# Altium schematic sheet Y1BVER2.0_1.SchDoc
size A3
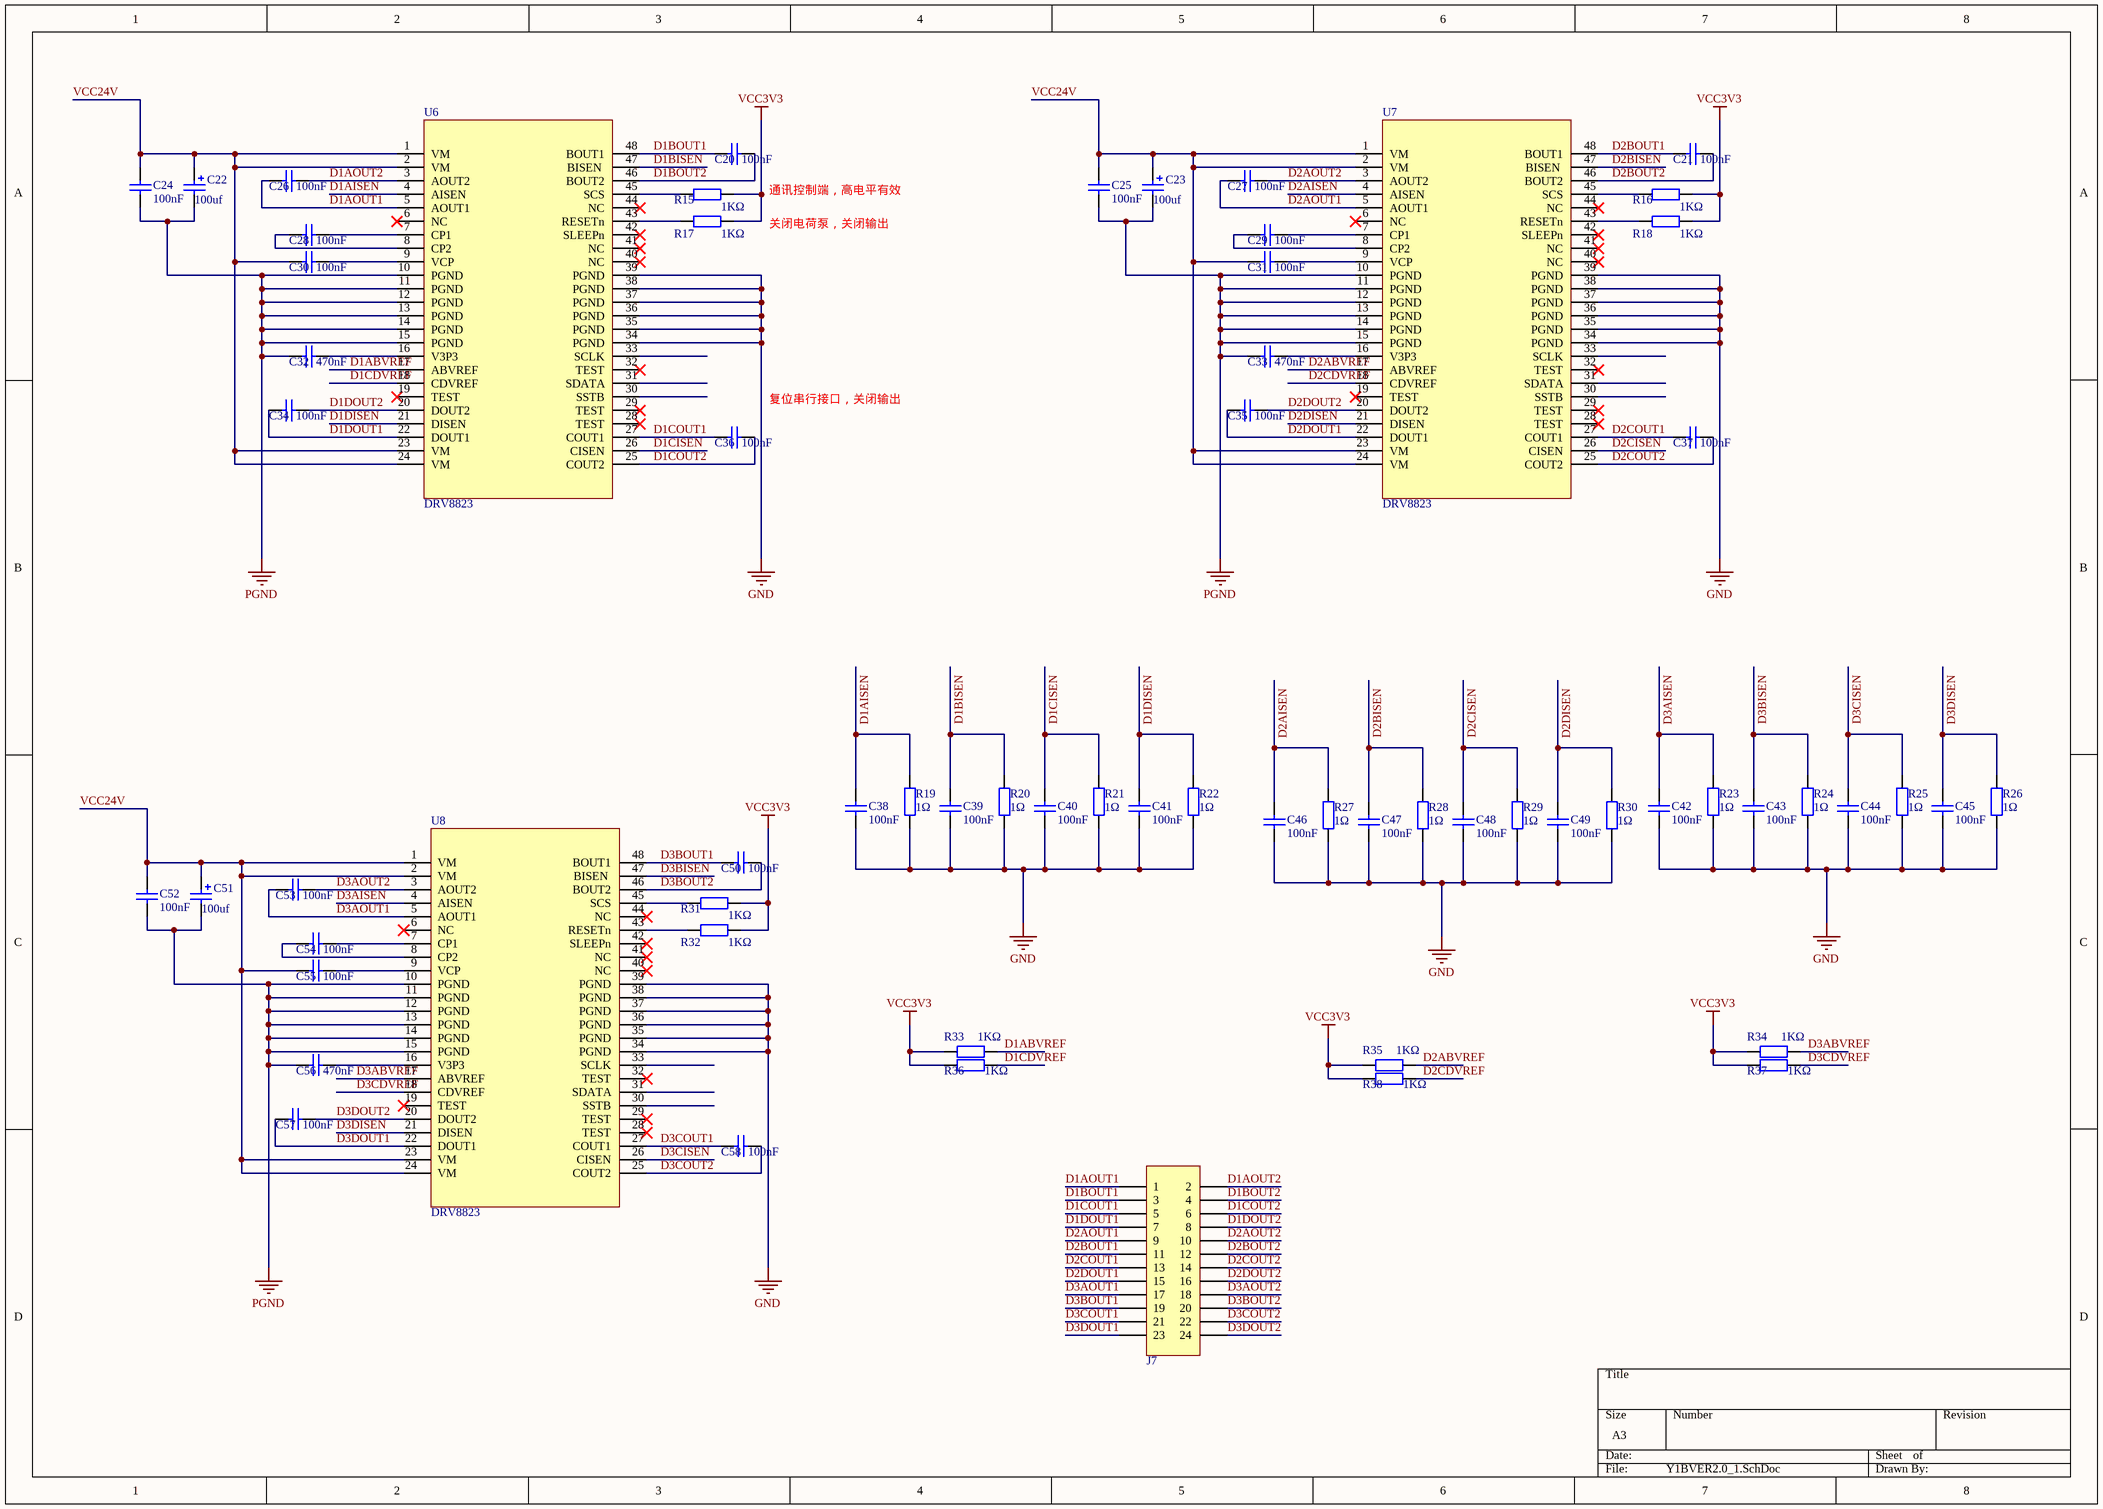
[diagram p0: Y1BVER2.0_1.SchDoc]

## Parts
C20  100nF  [0603_C]
C21  100nF  [0603_C]
C22  100uf  [E_6.3*5.4]
C23  100uf  [E_6.3*5.4]
C24  100nF  [0603_C]
C25  100nF  [0603_C]
C26  100nF  [0603_C]
C27  100nF  [0603_C]
C28  100nF  [0603_C]
C29  100nF  [0603_C]
C30  100nF  [0603_C]
C31  100nF  [0603_C]
C32  470nF  [0603_C]
C33  470nF  [0603_C]
C34  100nF  [0603_C]
C35  100nF  [0603_C]
C36  100nF  [0603_C]
C37  100nF  [0603_C]
C38  100nF  [0603_C]
C39  100nF  [0603_C]
C40  100nF  [0603_C]
C41  100nF  [0603_C]
C42  100nF  [0603_C]
C43  100nF  [0603_C]
C44  100nF  [0603_C]
C45  100nF  [0603_C]
C46  100nF  [0603_C]
C47  100nF  [0603_C]
C48  100nF  [0603_C]
C49  100nF  [0603_C]
C50  100nF  [0603_C]
C51  100uf  [E_6.3*5.4]
C52  100nF  [0603_C]
C53  100nF  [0603_C]
C54  100nF  [0603_C]
C55  100nF  [0603_C]
C56  470nF  [0603_C]
C57  100nF  [0603_C]
C58  100nF  [0603_C]
J7  header24p  [5557-2*12P]  (value not drawn)
R15  1KΩ  [0603_R]
R16  1KΩ  [0603_R]
R17  1KΩ  [0603_R]
R18  1KΩ  [0603_R]
R19  1Ω  [0603_R]
R20  1Ω  [0603_R]
R21  1Ω  [0603_R]
R22  1Ω  [0603_R]
R23  1Ω  [0603_R]
R24  1Ω  [0603_R]
R25  1Ω  [0603_R]
R26  1Ω  [0603_R]
R27  1Ω  [0603_R]
R28  1Ω  [0603_R]
R29  1Ω  [0603_R]
R30  1Ω  [0603_R]
R31  1KΩ  [0603_R]
R32  1KΩ  [0603_R]
R33  1KΩ  [0603_R]
R34  1KΩ  [0603_R]
R35  1KΩ  [0603_R]
R36  1KΩ  [0603_R]
R37  1KΩ  [0603_R]
R38  1KΩ  [0603_R]
U6  DRV8823  [HTSSOP-48]
U7  DRV8823  [HTSSOP-48]
U8  DRV8823  [HTSSOP-48]

## Nets
GND: C38.1 C39.1 C40.1 C41.1 C42.1 C43.1 C44.1 C45.1 C46.1 C47.1 C48.1 C49.1 R19.1 R20.1 R21.1 R22.1 R23.1 R24.1 R25.1 R26.1 R27.1 R28.1 R29.1 R30.1 U6.34(PGND) U6.35(PGND) U6.36(PGND) U6.37(PGND) U6.38(PGND) U6.39(PGND) U7.34(PGND) U7.35(PGND) U7.36(PGND) U7.37(PGND) U7.38(PGND) U7.39(PGND) U8.34(PGND) U8.35(PGND) U8.36(PGND) U8.37(PGND) U8.38(PGND) U8.39(PGND)
PGND: C22.2 C23.2 C24.1 C25.1 C32.1 C33.1 C51.2 C52.1 C56.1 U6.10(PGND) U6.11(PGND) U6.12(PGND) U6.13(PGND) U6.14(PGND) U6.15(PGND) U7.10(PGND) U7.11(PGND) U7.12(PGND) U7.13(PGND) U7.14(PGND) U7.15(PGND) U8.10(PGND) U8.11(PGND) U8.12(PGND) U8.13(PGND) U8.14(PGND) U8.15(PGND)
VCC3V3: R15.2 R16.2 R17.2 R18.2 R31.2 R32.2 R33.1 R34.1 R35.1 R36.1 R37.1 R38.1
D1ABVREF: R33.2 U6.17(ABVREF)
D1AISEN: C38.2 R19.2 U6.4(AISEN)
D1AOUT1: C26.1 J7.1 U6.5(AOUT1)
D1AOUT2: C26.2 J7.2 U6.3(AOUT2)
D1BISEN: C39.2 R20.2 U6.47(BISEN)
D1BOUT1: C20.1 J7.3 U6.48(BOUT1)
D1BOUT2: C20.2 J7.4 U6.46(BOUT2)
D1CDVREF: R36.2 U6.18(CDVREF)
D1CISEN: C40.2 R21.2 U6.26(CISEN)
D1COUT1: C36.1 J7.5 U6.27(COUT1)
D1COUT2: C36.2 J7.6 U6.25(COUT2)
D1DISEN: C41.2 R22.2 U6.21(DISEN)
D1DOUT1: C34.1 J7.7 U6.22(DOUT1)
D1DOUT2: C34.2 J7.8 U6.20(DOUT2)
D2ABVREF: R35.2 U7.17(ABVREF)
D2AISEN: C46.2 R27.2 U7.4(AISEN)
D2AOUT1: C27.1 J7.9 U7.5(AOUT1)
D2AOUT2: C27.2 J7.10 U7.3(AOUT2)
D2BISEN: C47.2 R28.2 U7.47(BISEN)
D2BOUT1: C21.1 J7.11 U7.48(BOUT1)
D2BOUT2: C21.2 J7.12 U7.46(BOUT2)
D2CDVREF: R38.2 U7.18(CDVREF)
D2CISEN: C48.2 R29.2 U7.26(CISEN)
D2COUT1: C37.1 J7.13 U7.27(COUT1)
D2COUT2: C37.2 J7.14 U7.25(COUT2)
D2DISEN: C49.2 R30.2 U7.21(DISEN)
D2DOUT1: C35.1 J7.15 U7.22(DOUT1)
D2DOUT2: C35.2 J7.16 U7.20(DOUT2)
D3ABVREF: R34.2 U8.17(ABVREF)
D3AISEN: C42.2 R23.2 U8.4(AISEN)
D3AOUT1: C53.1 J7.17 U8.5(AOUT1)
D3AOUT2: C53.2 J7.18 U8.3(AOUT2)
D3BISEN: C43.2 R24.2 U8.47(BISEN)
D3BOUT1: C50.1 J7.19 U8.48(BOUT1)
D3BOUT2: C50.2 J7.20 U8.46(BOUT2)
D3CDVREF: R37.2 U8.18(CDVREF)
D3CISEN: C44.2 R25.2 U8.26(CISEN)
D3COUT1: C58.1 J7.21 U8.27(COUT1)
D3COUT2: C58.2 J7.22 U8.25(COUT2)
D3DISEN: C45.2 R26.2 U8.21(DISEN)
D3DOUT1: C57.1 J7.23 U8.22(DOUT1)
D3DOUT2: C57.2 J7.24 U8.20(DOUT2)
VCC24V: C22.1 C23.1 C24.2 C25.2 C30.1 C31.1 C51.1 C52.2 C55.1 U6.1(VM) U6.2(VM) U6.23(VM) U6.24(VM) U7.1(VM) U7.2(VM) U7.23(VM) U7.24(VM) U8.1(VM) U8.2(VM) U8.23(VM) U8.24(VM)
NetC28_1: C28.1 U6.8(CP2)
NetC28_2: C28.2 U6.7(CP1)
NetC29_1: C29.1 U7.8(CP2)
NetC29_2: C29.2 U7.7(CP1)
NetC30_2: C30.2 U6.9(VCP)
NetC31_2: C31.2 U7.9(VCP)
NetC32_2: C32.2 U6.16(V3P3)
NetC33_2: C33.2 U7.16(V3P3)
NetC54_1: C54.1 U8.8(CP2)
NetC54_2: C54.2 U8.7(CP1)
NetC55_2: C55.2 U8.9(VCP)
NetC56_2: C56.2 U8.16(V3P3)
NetR15_1: R15.1 U6.45(SCS)
NetR16_1: R16.1 U7.45(SCS)
NetR17_1: R17.1 U6.43(RESETn)
NetR18_1: R18.1 U7.43(RESETn)
NetR31_1: R31.1 U8.45(SCS)
NetR32_1: R32.1 U8.43(RESETn)

Not connected (* = marked no-connect by the designer): U6 6(NC)* 19(TEST)* 28(TEST)* 29(TEST)* 30(SSTB) 31(SDATA) 32(TEST)* 33(SCLK) 40(NC)* 41(NC)* 42(SLEEPn)* 44(NC)*; U7 6(NC)* 19(TEST)* 28(TEST)* 29(TEST)* 30(SSTB) 31(SDATA) 32(TEST)* 33(SCLK) 40(NC)* 41(NC)* 42(SLEEPn)* 44(NC)*; U8 6(NC)* 19(TEST)* 28(TEST)* 29(TEST)* 30(SSTB) 31(SDATA) 32(TEST)* 33(SCLK) 40(NC)* 41(NC)* 42(SLEEPn)* 44(NC)*

## Notes on the sheet
- 通讯控制端，高电平有效
- 关闭电荷泵，关闭输出
- (near C36) 复位串行接口，关闭输出

## Library data of the parts
C20 C21 C24-C31 C34-C50 C52-C55 C57 C58 = 0603 100nF (104) 10% 50V: 贴片电容; ComponentLink1Description: 供应商链接; ComponentLink1URL: http://www.szlcsc.com/product/details_15331.html; Package: 0603; Supplier: LC; SuppliersPartNumber: C14663
C22 C23 C51 = C
C32 C33 C56 = 0603 470nF (474) 10% 25V: 贴片电容; ComponentLink1Description: 供应商链接; ComponentLink1URL: http://www.szlcsc.com/product/details_1975.html; Package: 0603; Supplier: LC; SuppliersPartNumber: C1623
R15-R18 R31-R38 = 0603 1KΩ (1001) 1%: 贴片电阻; ComponentLink1Description: 供应商链接; ComponentLink1URL: http://www.szlcsc.com/product/details_21904.html; Package: 0603; Supplier: LC; SuppliersPartNumber: C21190
R19-R30 = 0603 1Ω (1R00) 1%: 贴片电阻; ComponentLink1Description: 供应商链接; ComponentLink1URL: http://www.szlcsc.com/product/details_23663.html; Package: 0603; Supplier: LC; SuppliersPartNumber: C22936
U6-U8 = DRV8823: 4路BDC电机驱动